# Altium schematic sheet Sheet_2-copy_2024-07-28.schdoc
size 293 x 205 mm
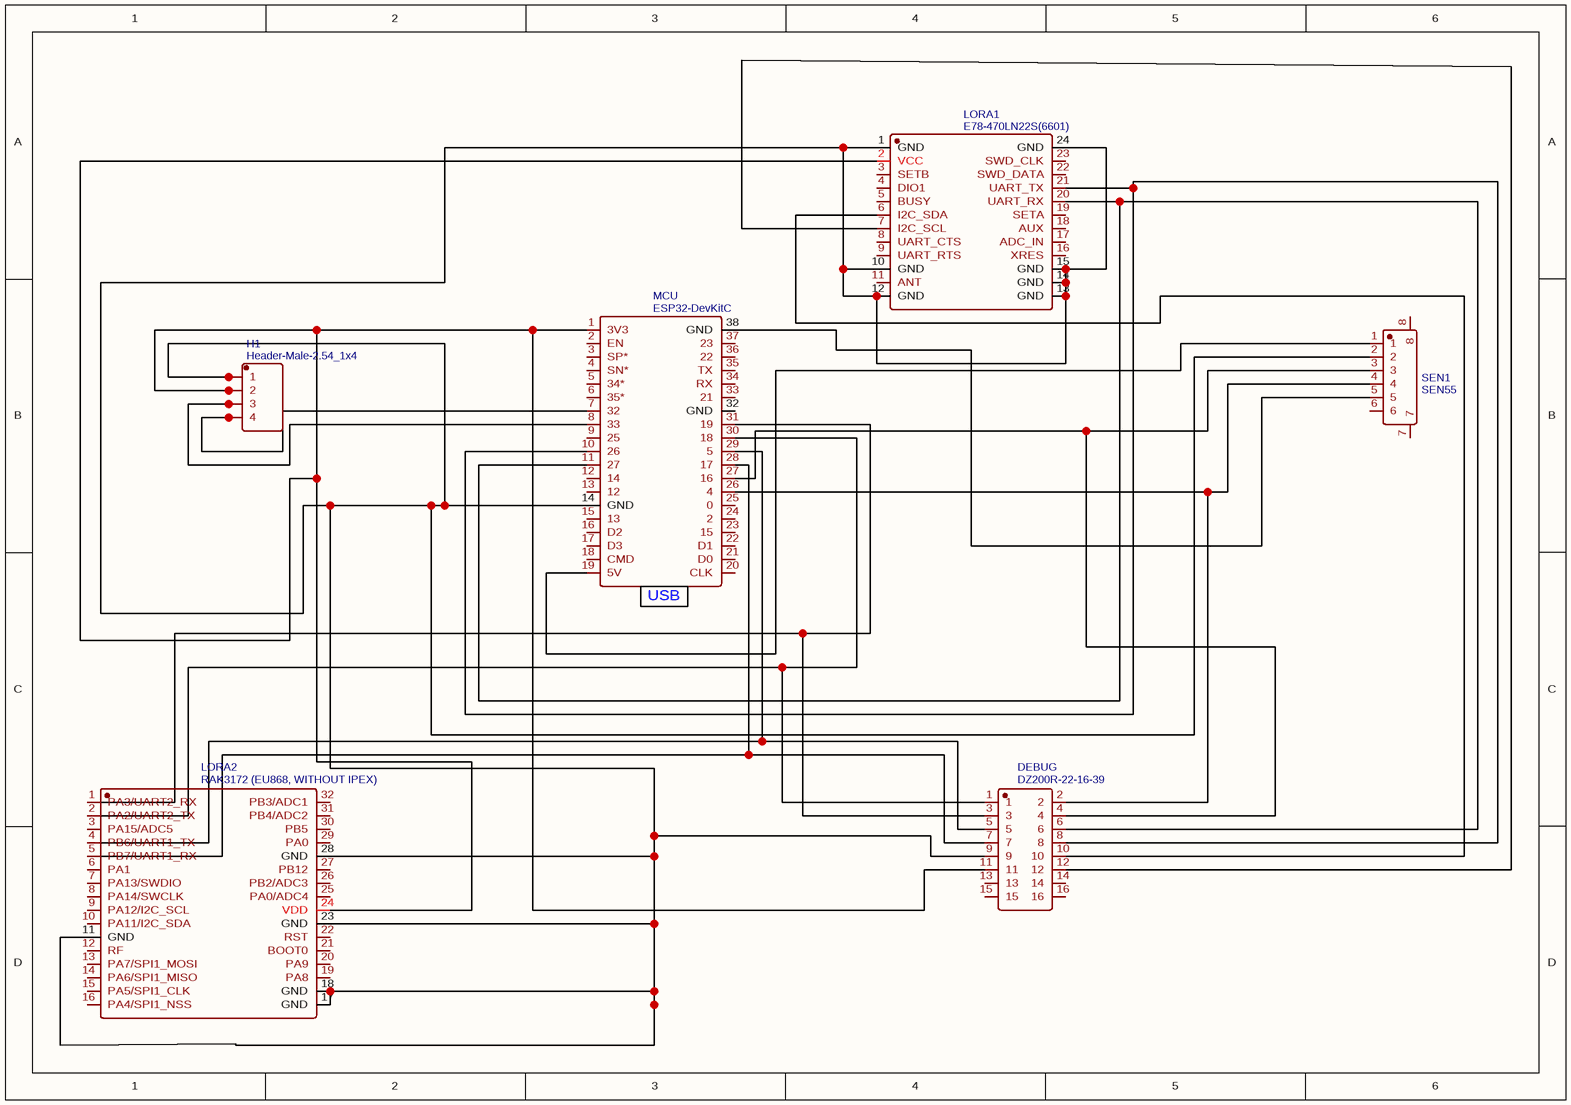
[diagram p0: Sheet_2-copy_2024-07-28.schdoc]

## Parts
DEBUG  DZ200R-22-16-39  [HDR-TH_16P-P2.00-V-M-R2-C8-S2.00]
H1  Header-Male-2.54_1x4  [HDR-TH_4P-P2.54-V-M]
LORA1  E78-470LN22S(6601)  [WIFIM-SMD_E78-470LN22S]
LORA2  RAK3172 (EU868, WITHOUT IPEX)  [LCC-40_L15.6-W15.0-P1.00_RAK3172]
MCU  ESP32-DevKitC  [ESP32-AZ-DELIVERY-38PIN-DIP]
SEN1  SEN55  [CONN-SMD_6P-P1.25_53261-0671]

## Nets
NetDEBUG_1: DEBUG.1 LORA2.2(PA2/UART2_TX) MCU.30(18)
NetDEBUG_2: DEBUG.2 MCU.26(4) SEN1.4
NetDEBUG_3: DEBUG.3 LORA2.1(PA3/UART2_RX) MCU.31(19)
NetDEBUG_4: DEBUG.4 MCU.27(16) SEN1.3
NetDEBUG_5: DEBUG.5 LORA2.4(PB6/UART1_TX) MCU.29(5)
NetDEBUG_6: DEBUG.6 LORA1.20(UART_RX) MCU.11(27)
NetDEBUG_7: DEBUG.7 LORA2.5(PB7/UART1_RX) MCU.28(17)
NetDEBUG_8: DEBUG.8 LORA1.21(UART_TX) MCU.10(26)
NetDEBUG_9: DEBUG.9 H1.1 LORA1.1(GND) LORA1.10(GND) LORA1.12(GND) LORA1.13(GND) LORA1.14(GND) LORA1.15(GND) LORA1.24(GND) LORA2.11(GND) LORA2.17(GND) LORA2.18(GND) LORA2.23(GND) LORA2.28(GND) MCU.14(GND) SEN1.2
NetDEBUG_10: DEBUG.10 LORA1.6(I2C_SDA)
NetDEBUG_11: DEBUG.11 H1.2 LORA1.2(VCC) LORA2.24(VDD) MCU.1(3V3)
NetDEBUG_12: DEBUG.12 LORA1.7(I2C_SCL)
NetH1_3: H1.3 MCU.8(33)
NetH1_4: H1.4 MCU.7(32)
NetMCU_19: MCU.19(5V) SEN1.1
NetMCU_38: MCU.38(GND) SEN1.5

Not connected (* = marked no-connect by the designer): DEBUG 13 14 15 16; LORA1 3(SETB) 4(DIO1) 5(BUSY) 8(UART_CTS) 9(UART_RTS) 11(ANT) 16(XRES) 17(ADC_IN) 18(AUX) 19(SETA) 22(SWD_DATA) 23(SWD_CLK); LORA2 3(PA15/ADC5) 6(PA1) 7(PA13/SWDIO) 8(PA14/SWCLK) 9(PA12/I2C_SCL) 10(PA11/I2C_SDA) 12(RF) 13(PA7/SPI1_MOSI) 14(PA6/SPI1_MISO) 15(PA5/SPI1_CLK) 16(PA4/SPI1_NSS) 19(PA8) 20(PA9) 21(BOOT0) 22(RST) 25(PA0/ADC4) 26(PB2/ADC3) 27(PB12) 29(PA0) 30(PB5) 31(PB4/ADC2) 32(PB3/ADC1); MCU 2(EN) 3(SP*) 4(SN*) 5(34*) 6(35*) 9(25) 12(14) 13(12) 15(13) 16(D2) 17(D3) 18(CMD) 20(CLK) 21(D0) 22(D1) 23(15) 24(2) 25(0) 32(GND) 33(21) 34(RX) 35(TX) 36(22) 37(23); SEN1 6 7 8

## Notes on the sheet
- (in symbol ESP32-DevKitC) USB

## Library data of the parts
DEBUG = DZ200R-22-16-39: Manufacturer: DEALON(德艺隆); Contributor: LCSC; Supplier: LCSC; Supplier Part: C2935963; Manufacturer Part: DZ200R-22-16-39; JLCPCB Part Class: Extended Part; link: https://lcsc.com/eda_search?q=C2935963&%26type=1&ref=editor; spicePre: H; spiceSymbolName: DZ200R-22-16-39
H1 = Header-Male-2.54_1x4: Manufacturer: Ckmtw(灿科盟); Manufacturer Part: B-2100S04P-A110; Contributor: LCSC; Supplier: LCSC; Supplier Part: C124378; JLCPCB Part Class: Extended Part; link: https://lcsc.com/eda_search?q=C124378&%26type=1&ref=editor; spicePre: H; spiceSymbolName: Header-Male-2.54_1x4
LORA1 = E78-470LN22S(6601): Manufacturer: EBYTE(亿佰特); Contributor: LCSC; Supplier: LCSC; Supplier Part: C2980725; Manufacturer Part: E78-470LN22S(6601); JLCPCB Part Class: Extended Part; spicePre: U; spiceSymbolName: E78-470LN22S(6601)
LORA2 = RAK3172 (EU868, WITHOUT IPEX): Manufacturer: null; Contributor: lcsc; Supplier: LCSC; Supplier Part: C2886287; Manufacturer Part: RAK3172 (EU868, without IPEX); JLCPCB Part Class: Extended Part; link: https://lcsc.com/eda_search?q=C2886287&%26type=1&ref=editor; spicePre: U; spiceSymbolName: RAK3172 (EU868, WITHOUT IPEX)
MCU = ESP32-DevKitC: Manufacturer: 32U WROOM; Contributor: Johanvd; Supplier: AZ-Delivery; spicePre: U; spiceSymbolName: ESP32-AZ-Delivery-DevkitC-V4
SEN1 = SEN55: Manufacturer: MOLEX; Manufacturer Part: 532610671; Contributor: LCSC; Supplier: LCSC; Supplier Part: C99277; JLCPCB Part Class: Extended Part; spicePre: C; spiceSymbolName: 53261-0671